# EAGLE schematic ultrasonic_signal_gen (EAGLE 9.6.2)
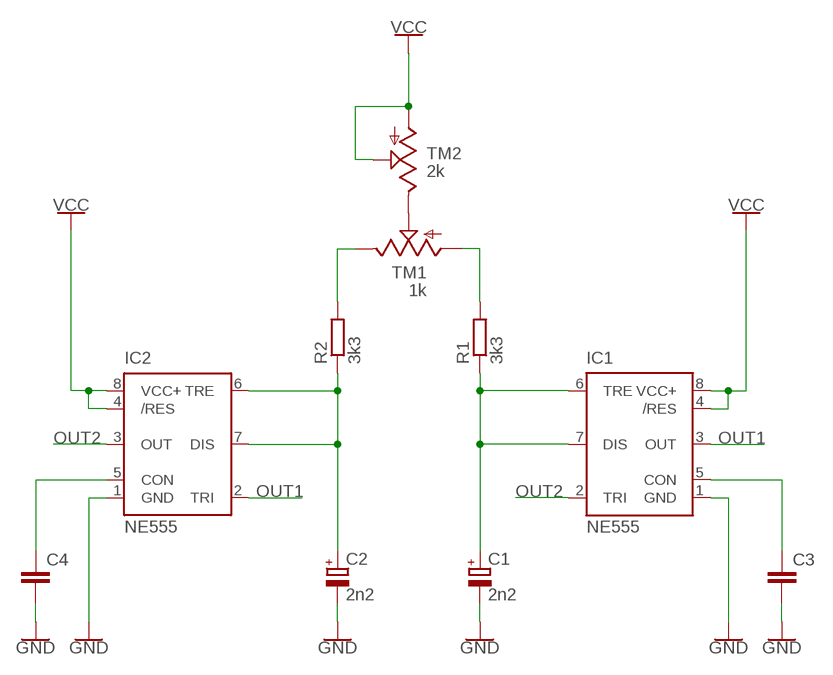
[diagram p0: schematic, sheet 1]

## Parts
C1  2n2  CPOL-EUE3.5-8  [E3,5-8]
C2  2n2  CPOL-EUE3.5-8  [E3,5-8]
C3  C-EU050-024X044  [C050-024X044]
C4  C-EU050-024X044  [C050-024X044]
IC1  NE555  [DIL-08]
IC2  NE555  [DIL-08]
R1  3k3  R-EU_0204/5  [0204/5]
R2  3k3  R-EU_0204/5  [0204/5]
TM1  1k  TRIM  [6MM]
TM2  2k  TRIM  [6MM]

## Nets
GND: C1.- C2.- C3.2 C4.2 IC1.1(GND) IC2.1(GND)
N$1: C1.+ IC1.6(TRE) IC1.7(DIS) R1.1
N$2: C3.1 IC1.5(CON)
N$3: C2.+ IC2.6(TRE) IC2.7(DIS) R2.1
N$4: IC1.4(/RES) IC1.8(VCC+) IC2.4(/RES) IC2.8(VCC+) ; supply symbol labelled VCC
N$5: TM2.A TM2.S ; supply symbol labelled VCC
N$6: C4.1 IC2.5(CON)
N$7: TM1.S TM2.E
N$8: R2.2 TM1.E
N$9: R1.2 TM1.A
OUT1: IC1.3(OUT) IC2.2(TRI)
OUT2: IC1.2(TRI) IC2.3(OUT)

## Library data of the parts
C1 C2 = rcl:CPOL-EU: POLARIZED CAPACITOR, European symbol; SPICEPREFIX: C
C3 C4 = rcl:C-EU: CAPACITOR, European symbol; SPICEPREFIX: C
IC1 IC2 = st-microelectronics:NE555: General purpose bipolar Timer; MF: Arrow Electronics; MPN: NE555N; OC_FARNELL: 1467742; OC_NEWARK: 89K1486
R1 R2 = rcl:R-EU_: RESISTOR, European symbol; SPICEPREFIX: R
TM1 TM2 = adafruit:TRIM